# Altium schematic sheet CLK_INPUT.SchDoc: Clock distribution
size 420 x 297 mm; Author: K.B.; CompanyName: WUT; DrawnBy: K.B.; Organization: WUT ISE; Address1: Warsaw Univeristy of Technology; Address2: Nowowiejska 15/19; DocumentNumber: 7; SheetNumber: 4; SheetTotal: 10; EDA_Number: ARTIQ; Projet: ARTIQ/SINARA; ModifiedBy: -; CreateDate: XX/XX/XXXX; CheckedDate: -; Title2: and generation; DivGrp: ISE; Designer: K.B.; ModifiedDate: -; ProjectName: ARTIQ/SINARA
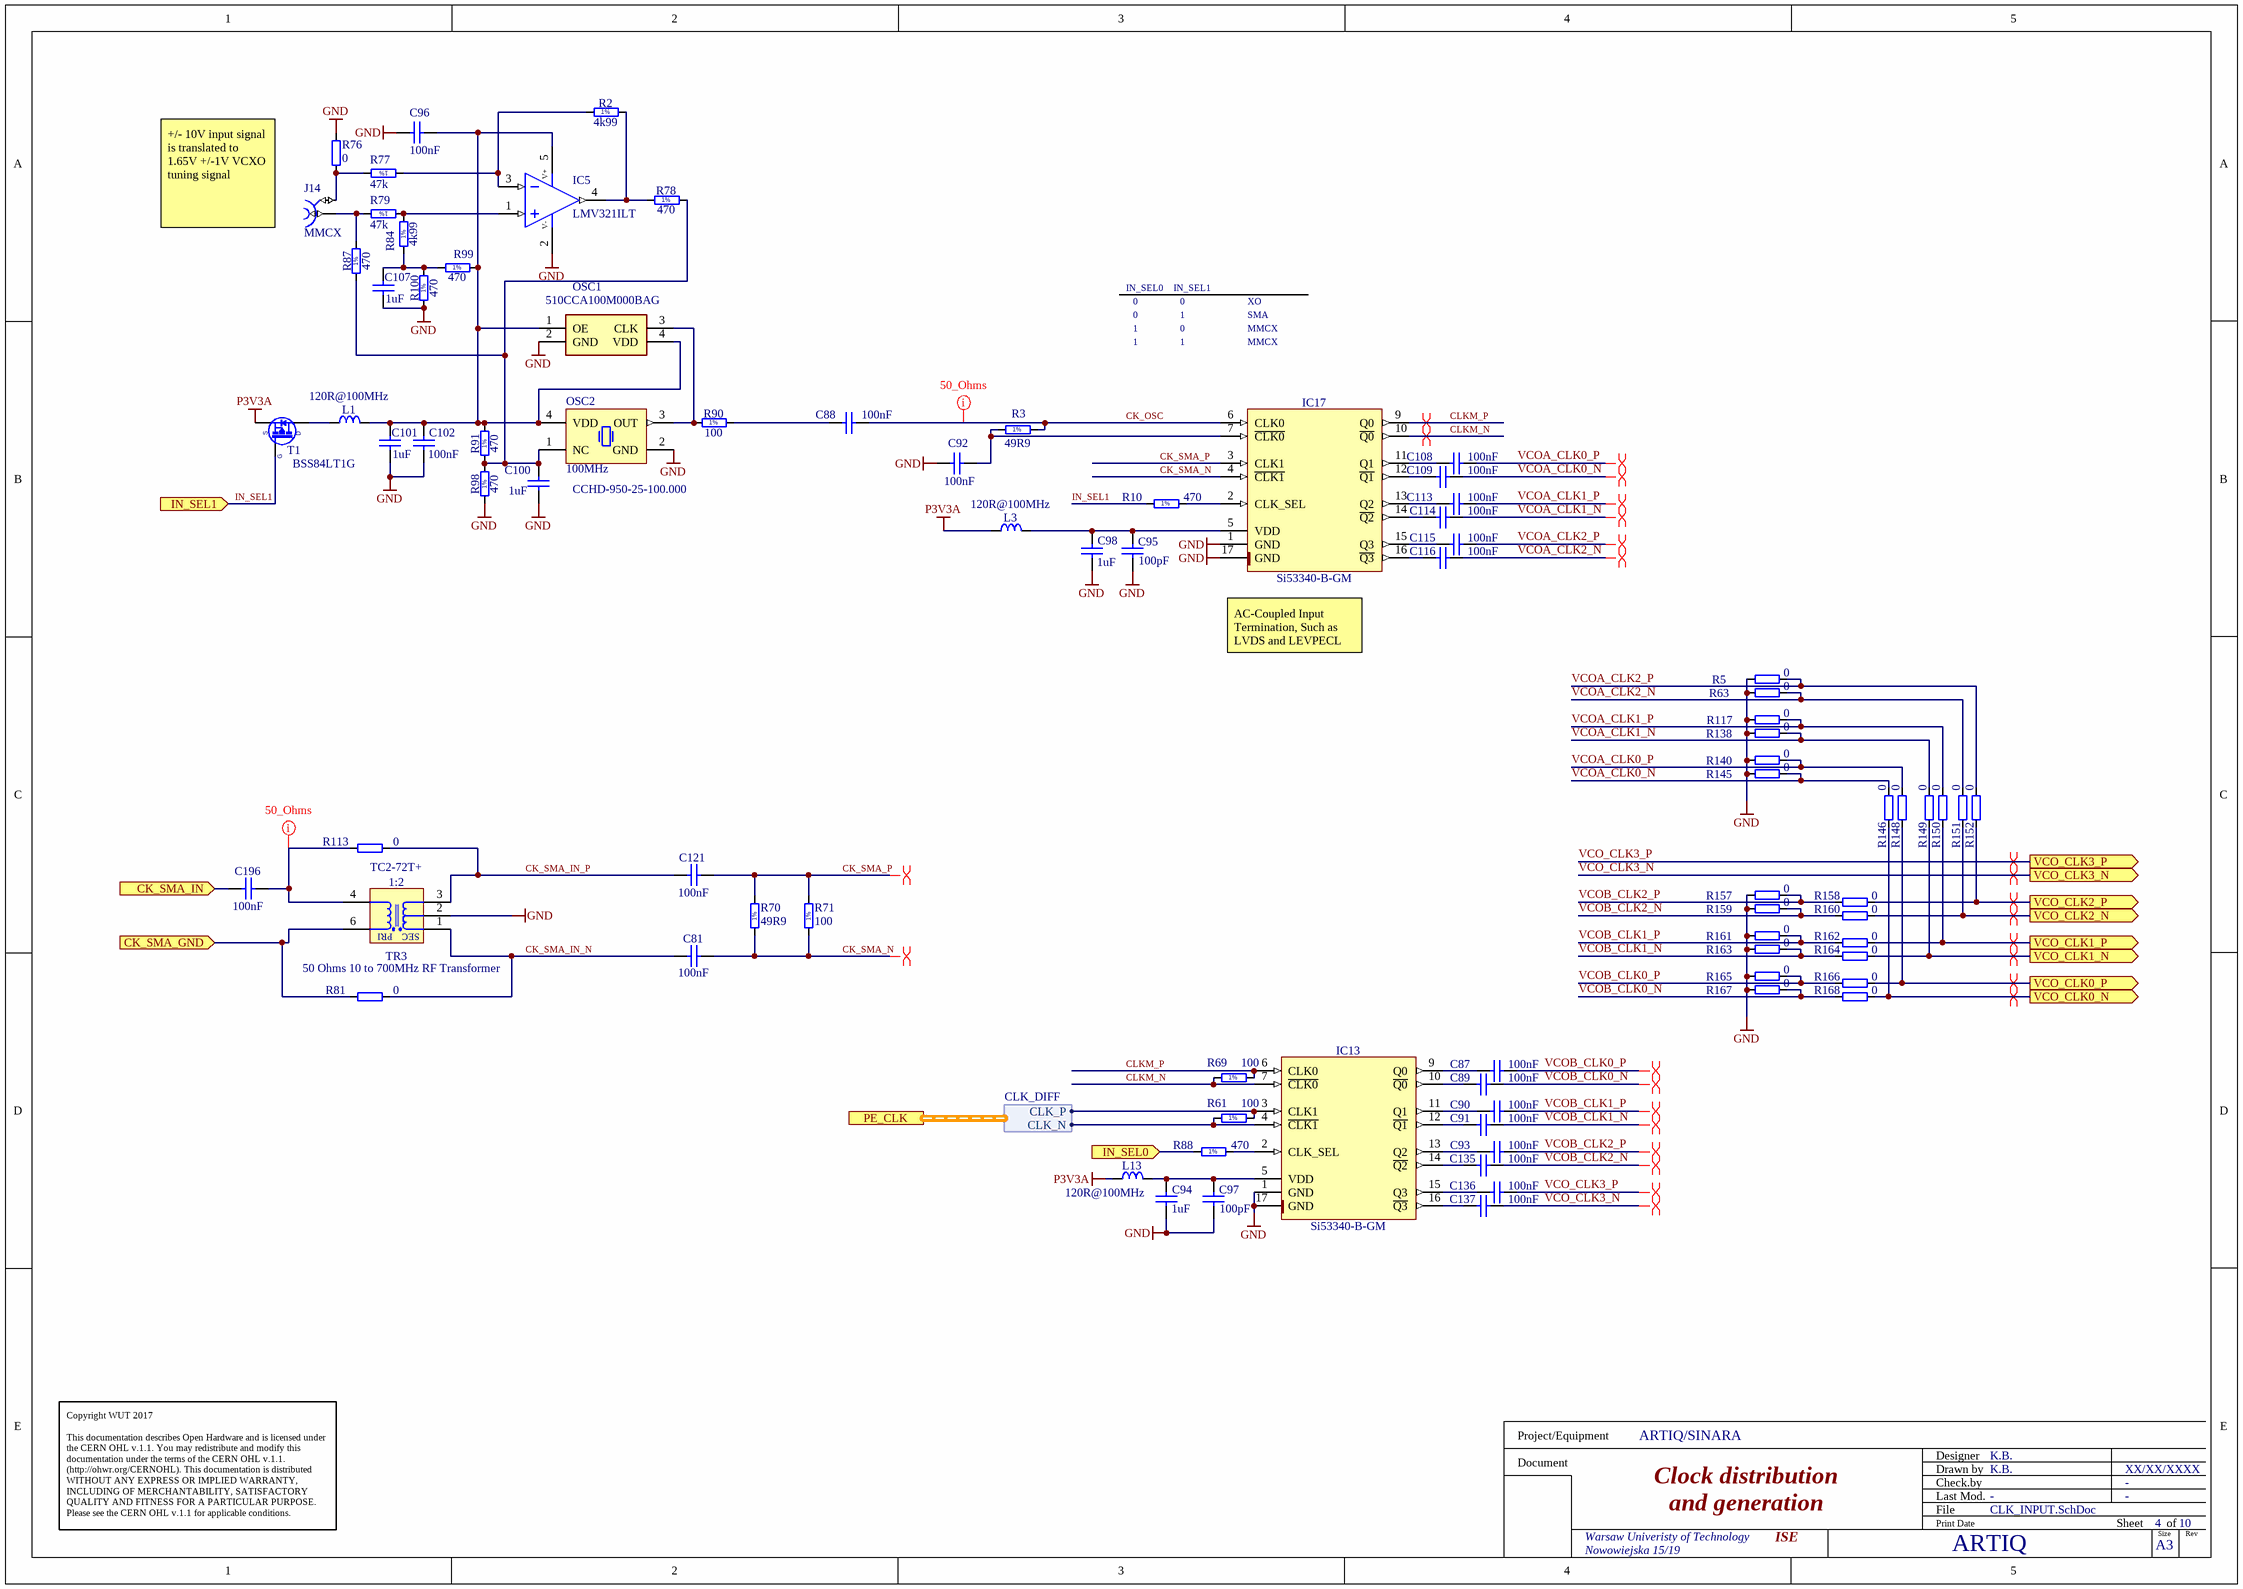
[diagram p0: CLK_INPUT.SchDoc]

## Parts
C81  100nF  [CAPC1005X55N]
C87  100nF  [CAPC1005X55N]
C88  100nF  [CAPC1005X55N]
C89  100nF  [CAPC1005X55N]
C90  100nF  [CAPC1005X55N]
C91  100nF  [CAPC1005X55N]
C92  100nF  [CAPC1005X55N]
C93  100nF  [CAPC1005X55N]
C94  1uF  [CAPC1005X55N]
C95  100pF  [CAPC1005X55N]
C96  100nF  [CAPC1005X55N]
C97  100pF  [CAPC1005X55N]
C98  1uF  [CAPC1005X55N]
C100  1uF  [CAPC1005X55N]
C101  1uF  [CAPC1005X55N]
C102  100nF  [CAPC1005X55N]
C107  1uF  [CAPC1005X55N]
C108  100nF  [CAPC1005X55N]
C109  100nF  [CAPC1005X55N]
C113  100nF  [CAPC1005X55N]
C114  100nF  [CAPC1005X55N]
C115  100nF  [CAPC1005X55N]
C116  100nF  [CAPC1005X55N]
C121  100nF  [CAPC1005X55N]
C135  100nF  [CAPC1005X55N]
C136  100nF  [CAPC1005X55N]
C137  100nF  [CAPC1005X55N]
C196  100nF  [CAPC1005X55N]
IC5  LMV321ILT  [SOT95P280X145-5N]
IC13  Si53340-B-GM  [QFN50P300X300X90-17N-S175]
IC17  Si53340-B-GM  [QFN50P300X300X90-17N-S175]
J14  MMCX  [SAMTEC_MMCX-J-P-H-ST-TH1]
L1  120R@100MHz  [INDC1608X95N]
L3  120R@100MHz  [INDC1608X95N]
L13  120R@100MHz  [INDC1608X95N]
OSC1  510CCA100M000BAG  [510CBA49M1520BAG]
OSC2  100MHz  Manufacturer Part Number: CCHD-950-25-100.000  [OSC_CRYSTEK_CCHD-950]
R2  4k99  [RESC1608X55N]
R3  49R9  [RESC1005X40N]
R5  0  [RESC1005X40N]
R10  470  [RESC1005X40N]
R61  100  [RESC1005X40N]
R63  0  [RESC1005X40N]
R69  100  [RESC1005X40N]
R70  49R9  [RESC1005X40N]
R71  100  [RESC1005X40N]
R76  0  [RESC1005X40N]
R77  47k  [RESC1608X55N]
R78  470  [RESC1608X55N]
R79  47k  [RESC1608X55N]
R81  0  [RESC1005X40N]
R84  4k99  [RESC1608X55N]
R87  470  [RESC1608X55N]
R88  470  [RESC1005X40N]
R90  100  [RESC1005X40N]
R91  470  [RESC1608X55N]
R98  470  [RESC1608X55N]
R99  470  [RESC1608X55N]
R100  470  [RESC1608X55N]
R113  0  [RESC1005X40N]
R117  0  [RESC1005X40N]
R138  0  [RESC1005X40N]
R140  0  [RESC1005X40N]
R145  0  [RESC1005X40N]
R146  0  [RESC1005X40N]
R148  0  [RESC1005X40N]
R149  0  [RESC1005X40N]
R150  0  [RESC1005X40N]
R151  0  [RESC1005X40N]
R152  0  [RESC1005X40N]
R157  0  [RESC1005X40N]
R158  0  [RESC1005X40N]
R159  0  [RESC1005X40N]
R160  0  [RESC1005X40N]
R161  0  [RESC1005X40N]
R162  0  [RESC1005X40N]
R163  0  [RESC1005X40N]
R164  0  [RESC1005X40N]
R165  0  [RESC1005X40N]
R166  0  [RESC1005X40N]
R167  0  [RESC1005X40N]
R168  0  [RESC1005X40N]
T1  BSS84LT1G  [SOT95P240X110-3N]
TR3  1:2  Manufacturer Part Number: TC2-72T+  Part Description: 50 Ohms 10 to 700MHz RF Transformer  [XFMR_MINI-CIRCUITS_AT1521]

## Ports
CK_SMA_GND (in), CK_SMA_IN (in), IN_SEL0 (in), IN_SEL1 (in), PE_CLK (harness CLK_DIFF), VCO_CLK0_N (out), VCO_CLK0_P (out), VCO_CLK1_N (out), VCO_CLK1_P (out), VCO_CLK2_N (out), VCO_CLK2_P (out), VCO_CLK3_N (out), VCO_CLK3_P (out)

## Harnesses
CLK_DIFF: CLK_N, CLK_P

## Nets
GND: C92.1 C94.1 C95.1 C96.1 C97.1 C98.1 C100.1 C101.1 C102.1 C107.1 IC5.2(V-) IC13.1(GND) IC13.17(GND) IC17.1(GND) IC17.17(GND) OSC1.2(GND) OSC2.2(GND) R5.1 R63.1 R76.2 R98.1 R100.1 R117.1 R138.1 R140.1 R145.1 R157.1 R159.1 R161.1 R163.1 R165.1 R167.1 TR3.2(NC)
P3V3A: L3.2 L13.2 T1.2(S)
CK_OSC: C88.2 IC17.6(CLK0) R3.2
CK_SMA_GND: R81.1 TR3.6(PDOT) ; port CK_SMA_GND
CK_SMA_IN: C196.1 ; port CK_SMA_IN
CK_SMA_IN_N: C81.1 R81.2 TR3.1(SDOT)
CK_SMA_IN_P: C121.1 R113.2 TR3.3(S)
CK_SMA_N: C81.2 IC17.4(~{CLK1}) R70.1 R71.1
CK_SMA_P: C121.2 IC17.3(CLK1) R70.2 R71.2
CLKM_N: IC13.7(~{CLK0}) IC17.10(~{Q0}) R69.1
CLKM_P: IC13.6(CLK0) IC17.9(Q0) R69.2
IN_SEL0: R88.1 ; port IN_SEL0
IN_SEL1: R10.1 T1.1(G) ; port IN_SEL1
VCO_CLK0_N: R146.1 R168.2 ; port VCO_CLK0_N
VCO_CLK0_P: R148.1 R166.2 ; port VCO_CLK0_P
VCO_CLK1_N: R149.1 R164.2 ; port VCO_CLK1_N
VCO_CLK1_P: R150.1 R162.2 ; port VCO_CLK1_P
VCO_CLK2_N: R151.1 R160.2 ; port VCO_CLK2_N
VCO_CLK2_P: R152.1 R158.2 ; port VCO_CLK2_P
VCO_CLK3_N: C137.1 ; port VCO_CLK3_N
VCO_CLK3_P: C136.1 ; port VCO_CLK3_P
VCOA_CLK0_N: C109.1 R145.2 R146.2
VCOA_CLK0_P: C108.1 R140.2 R148.2
VCOA_CLK1_N: C114.1 R138.2 R149.2
VCOA_CLK1_P: C113.1 R117.2 R150.2
VCOA_CLK2_N: C116.1 R63.2 R151.2
VCOA_CLK2_P: C115.1 R5.2 R152.2
VCOB_CLK0_N: C89.1 R167.2 R168.1
VCOB_CLK0_P: C87.1 R165.2 R166.1
VCOB_CLK1_N: C91.1 R163.2 R164.1
VCOB_CLK1_P: C90.1 R161.2 R162.1
VCOB_CLK2_N: C135.1 R159.2 R160.1
VCOB_CLK2_P: C93.1 R157.2 R158.1
NetC87_2: C87.2 IC13.9(Q0)
NetC88_1: C88.1 R90.2
NetC89_2: C89.2 IC13.10(~{Q0})
NetC90_2: C90.2 IC13.11(Q1)
NetC91_2: C91.2 IC13.12(~{Q1})
NetC92_2: C92.2 IC17.7(~{CLK0}) R3.1
NetC93_2: C93.2 IC13.13(Q2)
NetC94_2: C94.2 C97.2 IC13.5(VDD) L13.1
NetC95_2: C95.2 C98.2 IC17.5(VDD) L3.1
NetC96_2: C96.2 C101.2 C102.2 IC5.5(V+) L1.1 OSC1.1(OE) OSC1.4(VDD) OSC2.4(VDD) R91.2 R99.2
NetC100_2: C100.2 OSC2.1(NC) R78.2 R87.1 R91.1 R98.2
NetC107_2: C107.2 R84.1 R99.1 R100.2
NetC108_2: C108.2 IC17.11(Q1)
NetC109_2: C109.2 IC17.12(~{Q1})
NetC113_2: C113.2 IC17.13(Q2)
NetC114_2: C114.2 IC17.14(~{Q2})
NetC115_2: C115.2 IC17.15(Q3)
NetC116_2: C116.2 IC17.16(~{Q3})
NetC135_2: C135.2 IC13.14(~{Q2})
NetC136_2: C136.2 IC13.15(Q3)
NetC137_2: C137.2 IC13.16(~{Q3})
NetC196_2: C196.2 R113.1 TR3.4(P)
NetIC5_1: IC5.1(IN+) R79.1 R84.2
NetIC5_3: IC5.3(IN-) R2.1 R77.1
NetIC5_4: IC5.4(OUT) R2.2 R78.1
NetIC13_2: IC13.2(CLK_SEL) R88.2
NetIC13_3: IC13.3(CLK1) R61.2 ; port PE_CLK.CLK_P
NetIC13_4: IC13.4(~{CLK1}) R61.1 ; port PE_CLK.CLK_N
NetIC17_2: IC17.2(CLK_SEL) R10.2
NetJ14_1: J14.1 R79.2 R87.2
NetJ14_2: J14.2 R76.1 R77.2
NetL1_2: L1.2 T1.3(D)
NetOSC1_3: OSC1.3(CLK) OSC2.3(OUT) R90.1

## Layout directives
net class 50_Ohms: CK_OSC, NetC196_2
differential pair: CK_SMA_N, CK_SMA_P, CLKM_N, CLKM_P, VCO_CLK0_N, VCO_CLK0_P, VCO_CLK1_N, VCO_CLK1_P, VCO_CLK2_N, VCO_CLK2_P, VCO_CLK3_N, VCO_CLK3_P, VCOA_CLK0_N, VCOA_CLK0_P, VCOA_CLK1_N, VCOA_CLK1_P, VCOA_CLK2_N, VCOA_CLK2_P, VCOB_CLK0_N, VCOB_CLK0_P, VCOB_CLK1_N, VCOB_CLK1_P, VCOB_CLK2_N, VCOB_CLK2_P

## Notes on the sheet
- (near J14) +/- 10V input signal is translated to 1.65V +/-1V VCXO tuning signal
- IN_SEL0
- 0
- IN_SEL1
- 1
- XO
- SMA
- MMCX
- (near IC17) AC-Coupled Input Termination, Such as LVDS and LEVPECL
- Copyright WUT 2017
  This documentation describes Open Hardware and is licensed under the CERN OHL v.1.1. You may redistribute and modify this documentation under the terms of the CERN OHL v.1.1. (http://ohwr.org/CERNOHL). This documentation is distributed WITHOUT ANY EXPRESS OR IMPLIED WARRANTY, INCLUDING OF MERCHANTABILITY, SATISFACTORY QUALITY AND FITNESS FOR A PARTICULAR PURPOSE. Please see the CERN OHL v.1.1 for applicable conditions.
- Project/Equipment
- Document
- Designer
- Drawn by
- Check.by
- File
- Last Mod.
- Print Date
- Sheet
- Size
- A3
- of
- Rev
- (in symbol R0402_49R9_1%_0.0625W_100PPM) 1%
- (in symbol R0402_100R_1%_0.0625W_100PPM) 1%
- (in symbol R0402_470R_1%_0.0625W_100PPM) 1%
- (in symbol R0603_4K99_1%_0.063W_50PPM) 1%
- (in symbol R0603_47K_1%_0.1W_100PPM) 1%
- (in symbol R0603_470R_1%_0.1W_100PPM) 1%
- (in symbol XFMR_MINI-CIRCUITS_TC2-72T+) PRI; SEC

## Library data of the parts
C81 C87-C93 C96 C102 C108 C109 C113-C116 C121 C135-C137 C196 = CC0402_100NF_16V_10%_X5R: Non-polarised capacitor; Part Description: SMD Multilayer Chip Ceramic Capacitor; Manufacturer: GENERIC; Manufacturer1 Part Number: GRM155R61C104KA88D; Voltage: 16V; TC: X5R; Tolerance: ±10%; Part Number: CC0402_100NF_16V_10%_X5R; Component Kind: Standard; Component Type: Standard; Pin Count: 2; Value: 100nF; Status: None; Manufacturer Part Number: CC0402_100NF_16V_10%_X5R; Case: 0402; Mounted: Yes; Socket: No; SMD: Yes; Sense: No; Manufacturer1 Example: MURATA; Manufacturer1 ComponentHeight: 0.55mm; HelpURL: \\cern.ch\dfs\Applications\Altium\Datasheets\CC0402_X5R_MURATA_GRM.pdf; Author: CERN DEM JLC; CreateDate: 10.12.2013; LatestRevisionDate: 10.12.2013
C94 C98 C100 C101 C107 = CC0402_1UF_16V_10%_X5R: Non-polarised capacitor; Part Description: SMD Multilayer Chip Ceramic Capacitor; Manufacturer: GENERIC; Manufacturer1 Part Number: C1005X5R1C105KT; Voltage: 16V; TC: X5R; Tolerance: ±10%; Part Number: CC0402_1UF_16V_10%_X5R; Component Kind: Standard; Component Type: Standard; Pin Count: 2; Value: 1uF; Status: Preferred; Manufacturer Part Number: CC0402_1UF_16V_10%_X5R; Case: 0402; Mounted: Yes; Socket: No; SMD: Yes; Sense: No; Manufacturer1 Example: TDK; Manufacturer1 ComponentHeight: 0.55mm; HelpURL: \\cern.ch\dfs\Applications\Altium\Datasheets\CC0402_X5R_TDK_C.pdf; Author: CERN DEM JLC; CreateDate: 2012-10-25; LatestRevisionDate: 2012-10-25
C95 C97 = CC0402_100PF_50V_5%_C0G: Non-polarised capacitor; Part Description: SMD Multilayer Chip Ceramic Capacitor; Manufacturer: GENERIC; Manufacturer1 Part Number: C0402C101J5GACTU; Voltage: 50V; TC: C0G/NP0; Tolerance: ±5%; Part Number: CC0402_100PF_50V_5%_C0G; Component Kind: Standard; Component Type: Standard; Pin Count: 2; Value: 100pF; Status: Preferred; Manufacturer Part Number: CC0402_100PF_50V_5%_C0G; Case: 0402; Mounted: Yes; Socket: No; SMD: Yes; Sense: No; Manufacturer1 Example: KEMET; Manufacturer1 ComponentHeight: 0.55mm; HelpURL: \\cern.ch\dfs\Applications\Altium\Datasheets\CC0805_C0G_KEMET_(Commercial Grade).pdf; Author: CERN DEM JLC; CreateDate: 03.12.2007; LatestRevisionDate: 22.04.2015
IC5 = LMV321ILT: Operational Amplifier; Part Description: Low Cost, Low Power, Input/Output Rail-To-Rail Operational Amplifiers; Manufacturer: ST MICROELECTRONICS; PressFit: No; Bonding: No; Part Number: LMV321ILT; Component Kind: Standard; Component Type: Standard; Device: LMV321ILT; PackageDescription: SOT, 0.95mm pitch; 5 pin, 1.60mm W X 2.90mm L X 1.45mm H body, IPC Medium Density; Manufacturer Part Number: LMV321ILT; Pin Count: 5; Case: SOT23-5; Mounted: Yes; Socket: No; SMD: Yes; Sense: No; ComponentHeight: 1.45mm; Author: CERN DEM MR; HelpURL: \\cern.ch\dfs\Applications\Altium\Datasheets\LMV321ILT.pdf; CreateDate: 02/10/2017; LatestRevisionDate: 02/10/2017
IC13 IC17 = Si53340-B-GM: Low-Jitter LVDS Fanout Clock Buffers, 10-Output,  Any-Input, Any-Frequency up to 1250MHz; Manufacturer: SILICON LABS; PressFit: No; Bonding: No; Part Number: Si53340-B-GM; Component Kind: Standard; Component Type: Standard; Device: Si53340-B-GM; PackageDescription: QFN, 0.50mm Pitch, Square; 16 Pin, 3.00mm L X 3.00mm W X 0.90mm H Body (w/thermal tab 1.75mm x 1.75mm), IPC Medium Density; Part Description: Low-Jitter LVDS Fanout Clock Buffers, 10-Output,  Any-Input, Any-Frequency up to 1250MHz; Manufacturer Part Number: Si53340-B-GM; Pin Count: 17; Case: QFN16; Mounted: Yes; Socket: No; SMD: Yes; Sense: No; ComponentHeight: 0.9mm; HelpURL: \\cern.ch\dfs\Applications\Altium\Datasheets\Si53340-B-GM.pdf; Author: CERN DEM MR; CreateDate: 04.09.2017; LatestRevisionDate: 04.09.2017
J14 = SAMTEC_MMCX-J-P-H-ST-TH1: Part Description: Straight Through-hole 50 Ohm Micro Mini RF Jack, MMCX Series; Manufacturer: SAMTEC; PressFit: No; Part Number: SAMTEC_MMCX-J-P-H-ST-TH1; Component Kind: Standard; Component Type: Standard; Pin Count: 2; Mounted: Yes; Socket: No; Sense: No; SMD: No; Status: None; Manufacturer Part Number: MMCX-J-P-H-ST-TH1; ComponentHeight: 4.35mm; HelpURL: \\cern.ch\dfs\Applications\Altium\Datasheets\SAMTEC_MMCX-J-P-H-ST-TH1.pdf; Author: CERN DEM JLC; CreateDate: 05.12.2012; LatestRevisionDate: 05.12.2012
L1 L3 L13 = IND0603_MURATA_BLM18PG121SN1D: Inductor; Part Description: SMD EMIFIL Chip Ferrite Bead; Manufacturer: MURATA; Power: 2A; Resistance: 0.05R; Part Number: IND0603_MURATA_BLM18PG121SN1D; Component Kind: Standard; Component Type: Standard; Pin Count: 2; Value: 120R@100MHz; Status: None; Manufacturer Part Number: BLM18PG121SN1D; Case: 0603; Mounted: Yes; Socket: No; SMD: Yes; Sense: No; ComponentHeight: 0.95mm; HelpURL: \\cern.ch\dfs\Applications\Altium\Datasheets\IND0603_MURATA_BLM18P.pdf; Author: CERN DEM BC; CreateDate: 2015-07-27; LatestRevisionDate: 2015-07-27
OSC1 = 510CCA100M000BAG: Crystal or Oscillator; Manufacturer_Name: Silicon Labs; Datasheet Link: https://www.silabs.com/documents/public/data-sheets/si510-11.pdf; Height: 1mm; Manufacturer_Part_Number: 510CCA100M000BAG; Mouser Part Number: 634-510CCA100M000BAG; Mouser Price/Stock: https://www.mouser.com/Search/Refine.aspx?Keyword=634-510CCA100M000BAG
OSC2 = OSC_CCHD-950: 100MHz low noise oscillator; Part Number: OSC_100MHZ_CRYSTEK_CCHD-950-25-100.000; Part Description: 3.3V, ±25ppm, 0..70°C, CMOS Surface Mount Ultra-Low Noise Oscillator (CCHD-950 Series); Manufacturer: CRYSTEK CRYSTAL; PressFit: No; Bonding: No; Component Kind: Standard; Component Type: Standard; PackageDescription: Oscillator, 5.08mm Pitch; 4 Pin, 14.2mm L X 9.14mm W X 5.3mm H, CCHD-950 Serie; Value: 100MHz; Pin Count: 4; Mounted: Yes; Socket: No; SMD: Yes; Sense: No; ComponentHeight: 5.3mm; HelpURL: \\cern.ch\dfs\Applications\Altium\Datasheets\OSC_CRYSTEK_CVHD-950.pdf; Author: GK; CreateDate: 04.11.2016; LatestRevisionDate: 04.11.2016
R2 R84 = R0603_4K99_1%_0.063W_50PPM: Resistor - 1%; Part Description: General Purpose Thick Film Chip Resistor; Manufacturer: GENERIC; Manufacturer1 Part Number: CPF0603F4K99C1; Power: 0.063W; TC: ±50ppm/°C; PressFit: No; Part Number: R0603_4K99_1%_0.063W_50PPM; Component Kind: Standard; Component Type: Standard; Pin Count: 2; Value: 4k99; Status: None; Tolerance: ±1%; Manufacturer Part Number: R0603_4K99_1%_0.063W_50PPM; Case: 0603; Mounted: Yes; Sense: No; Socket: No; SMD: Yes; Manufacturer1 Example: TYCO NEOHM; Manufacturer1 ComponentHeight: 0.55mm; HelpURL: \\cern.ch\dfs\Applications\Altium\Datasheets\R0603_TYCO_CPF.pdf; Author: CERN DEM JLC; CreateDate: 20.05.2010; LatestRevisionDate: 20.05.2010
R3 R70 = R0402_49R9_1%_0.0625W_100PPM: Resistor - 1%; Part Description: General Purpose Thick Film Chip Resistor; Manufacturer: GENERIC; Manufacturer1 Part Number: 232270674999L or RC0402FR-0749R9L; TC: ±100ppm/°C; PressFit: No; Part Number: R0402_49R9_1%_0.0625W_100PPM; Component Kind: Standard; Component Type: Standard; Pin Count: 2; Value: 49R9; Status: Not Recommended; Power: 0.0625W; Tolerance: ±1%; Manufacturer Part Number: R0402_49R9_1%_0.0625W_100PPM; Case: 0402; Mounted: Yes; Sense: No; Socket: No; SMD: Yes; Manufacturer1 Example: YAGEO PHYCOMP; Manufacturer1 ComponentHeight: 0.4mm; HelpURL: \\cern.ch\dfs\Applications\Altium\Datasheets\R0402_Phycomp_RC0402.pdf; Author: CERN DEM JLC; CreateDate: 24.10.2012; LatestRevisionDate: 24.10.2012
R5 R63 R76 R81 R113 R117 R138 R140 R145 R146 R148-R152 R157-R168 = R0402_0R_JUMPER: Resistor; Part Description: 1A (0.05R Max DC Resistance) Zero Ohm Jumper; Manufacturer: GENERIC; Manufacturer1 Part Number: 232270591001L; PressFit: No; Part Number: R0402_0R_JUMPER; Component Kind: Standard; Component Type: Standard; Pin Count: 2; Value: 0; Status: Not Recommended; Manufacturer Part Number: R0402_0R_JUMPER; Case: 0402; Mounted: Yes; Sense: No; Socket: No; SMD: Yes; Manufacturer1 Example: YAGEO PHYCOMP; Manufacturer1 ComponentHeight: 0.4mm; HelpURL: \\cern.ch\dfs\Applications\Altium\Datasheets\R0402_Phycomp_RC0402.pdf; Author: CERN DEM JLC; CreateDate: 03.12.2007; LatestRevisionDate: 17.10.2012
R10 R88 = R0402_470R_1%_0.0625W_100PPM: Resistor - 1%; Part Description: General Purpose Thick Film Chip Resistor; Manufacturer: GENERIC; Manufacturer1 Part Number: 232270674701L; TC: ±100ppm/°C; PressFit: No; Part Number: R0402_470R_1%_0.0625W_100PPM; Component Kind: Standard; Component Type: Standard; Pin Count: 2; Value: 470; Status: Not Recommended; Power: 0.0625W; Tolerance: ±1%; Manufacturer Part Number: R0402_470R_1%_0.0625W_100PPM; Case: 0402; Mounted: Yes; Sense: No; Socket: No; SMD: Yes; Manufacturer1 Example: YAGEO PHYCOMP; Manufacturer1 ComponentHeight: 0.4mm; HelpURL: \\cern.ch\dfs\Applications\Altium\Datasheets\R0402_Phycomp_RC0402.pdf; Author: CERN DEM JLC; CreateDate: 03.12.2007; LatestRevisionDate: 17.10.2012
R61 R69 R71 R90 = R0402_100R_1%_0.0625W_100PPM: Resistor - 1%; Part Description: General Purpose Thick Film Chip Resistor; Manufacturer: GENERIC; Manufacturer1 Part Number: 232270671001L; TC: ±100ppm/°C; PressFit: No; Part Number: R0402_100R_1%_0.0625W_100PPM; Component Kind: Standard; Component Type: Standard; Pin Count: 2; Value: 100; Status: Not Recommended; Power: 0.0625W; Tolerance: ±1%; Manufacturer Part Number: R0402_100R_1%_0.0625W_100PPM; Case: 0402; Mounted: Yes; Sense: No; Socket: No; SMD: Yes; Manufacturer1 Example: YAGEO PHYCOMP; Manufacturer1 ComponentHeight: 0.4mm; HelpURL: \\cern.ch\dfs\Applications\Altium\Datasheets\R0402_Phycomp_RC0402.pdf; Author: CERN DEM JLC; CreateDate: 03.12.2007; LatestRevisionDate: 17.10.2012
R77 R79 = R0603_47K_1%_0.1W_100PPM: Resistor - 1%; Part Description: General Purpose Thick Film Chip Resistor; Manufacturer: GENERIC; Manufacturer1 Part Number: NRC06F4702TRF; Power: 0.1W; TC: ±100ppm/°C; Part Number: R0603_47K_1%_0.1W_100PPM; Component Kind: Standard; Component Type: Standard; Pin Count: 2; Value: 47k; Status: Preferred; Tolerance: ±1%; Manufacturer Part Number: R0603_47K_1%_0.1W_100PPM; Case: 0603; Mounted: Yes; Sense: No; Socket: No; SMD: Yes; Manufacturer1 Example: NIC COMPONENT; Manufacturer1 ComponentHeight: 0.55mm; HelpURL: \\cern.ch\dfs\Applications\Altium\Datasheets\R0603_NIC_NRC.pdf; Author: CERN DEM JLC; CreateDate: 03.12.2007; LatestRevisionDate: 13.03.2008
R78 R87 R91 R98-R100 = R0603_470R_1%_0.1W_100PPM: Resistor - 1%; Part Description: General Purpose Thick Film Chip Resistor; Manufacturer: GENERIC; Manufacturer1 Part Number: NRC06F4700TRF; Power: 0.1W; TC: ±100ppm/°C; PressFit: No; Part Number: R0603_470R_1%_0.1W_100PPM; Component Kind: Standard; Component Type: Standard; Pin Count: 2; Value: 470; Status: Preferred; Tolerance: ±1%; Manufacturer Part Number: R0603_470R_1%_0.1W_100PPM; Case: 0603; Mounted: Yes; Sense: No; Socket: No; SMD: Yes; Manufacturer1 Example: NIC COMPONENT; Manufacturer1 ComponentHeight: 0.55mm; HelpURL: \\cern.ch\dfs\Applications\Altium\Datasheets\R0603_NIC_NRC.pdf; Author: CERN DEM JLC; CreateDate: 03.12.2007; LatestRevisionDate: 13.03.2008
T1 = BSS84LT1G: P-CHANNEL MOSFET WITH DIODE; Part Description: 50V 130mA Single P-Channel Power MOSFET; Manufacturer: ON SEMICONDUCTOR; PressFit: No; Bonding: No; Part Number: BSS84LT1G; Component Kind: Standard; Component Type: Standard; Device: BSS84LT1G; PackageDescription: SOT23 3-Leads, Pitch 0.95mm - Body 1.4x3mm, IPC Medium Density; Manufacturer Part Number: BSS84LT1G; Pin Count: 3; Case: SOT23-3; Mounted: Yes; Socket: No; SMD: Yes; Sense: No; ComponentHeight: 1.1mm; HelpURL: \\cern.ch\dfs\Applications\Altium\Datasheets\BSS84LT1G.pdf; Author: CERN DEM JLC; CreateDate: 29.03.2012; LatestRevisionDate: 29.03.2012
TR3 = XFMR_MINI-CIRCUITS_TC2-72T+: 50 Ohms 10 to 700 MHzz RF Transformer; Manufacturer: MINI-CIRCUITS; HelpURL: \\cern.ch\dfs\Applications\Altium\Datasheets\XFMR_MINI-CIRCUITS_TC2-1TX+.pdf; Part Number: XFMR_MINI-CIRCUITS_TC2-72T+; Component Kind: Standard; Component Type: Standard; Pin Count: 5; Value: 1:2; Status: None; Mounted: Yes; Socket: No; Sense: No; SMD: Yes; ComponentHeight: 4.06mm; Author: GK; CreateDate: 18.10.2019; LatestRevisionDate: 18.10.2019